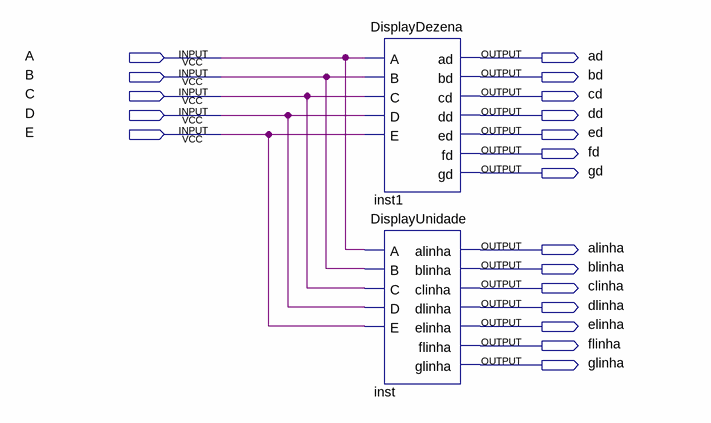
[diagram p0: schematic sheet]
// Quartus schematic Display14Segments.bdf as structural Verilog: 2 symbols, 19 pins
module Display14Segments (
  input  A,
  input  B,
  input  C,
  input  D,
  input  E,
  output ad,
  output bd,
  output cd,
  output dd,
  output ed,
  output fd,
  output gd,
  output alinha,
  output blinha,
  output clinha,
  output dlinha,
  output elinha,
  output flinha,
  output glinha
);

  DisplayDezena inst1 (
    .A(A), .B(B), .C(C), .D(D), .E(E), .ad(ad), .bd(bd), .cd(cd), .dd(dd), .ed(ed), .fd(fd), .gd(gd));
  DisplayUnidade inst (
    .A(A), .B(B), .C(C), .D(D), .E(E), .alinha(alinha), .blinha(blinha), .clinha(clinha), .dlinha(dlinha),
    .elinha(elinha), .flinha(flinha), .glinha(glinha));
endmodule
